# Altium schematic sheet MCU.SchDoc
size A4; SheetNumber: 1; SheetTotal: 1
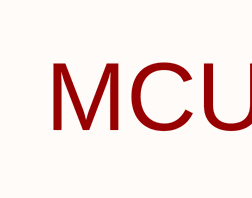
[diagram p0: MCU.SchDoc]

## Notes on the sheet
- MCU